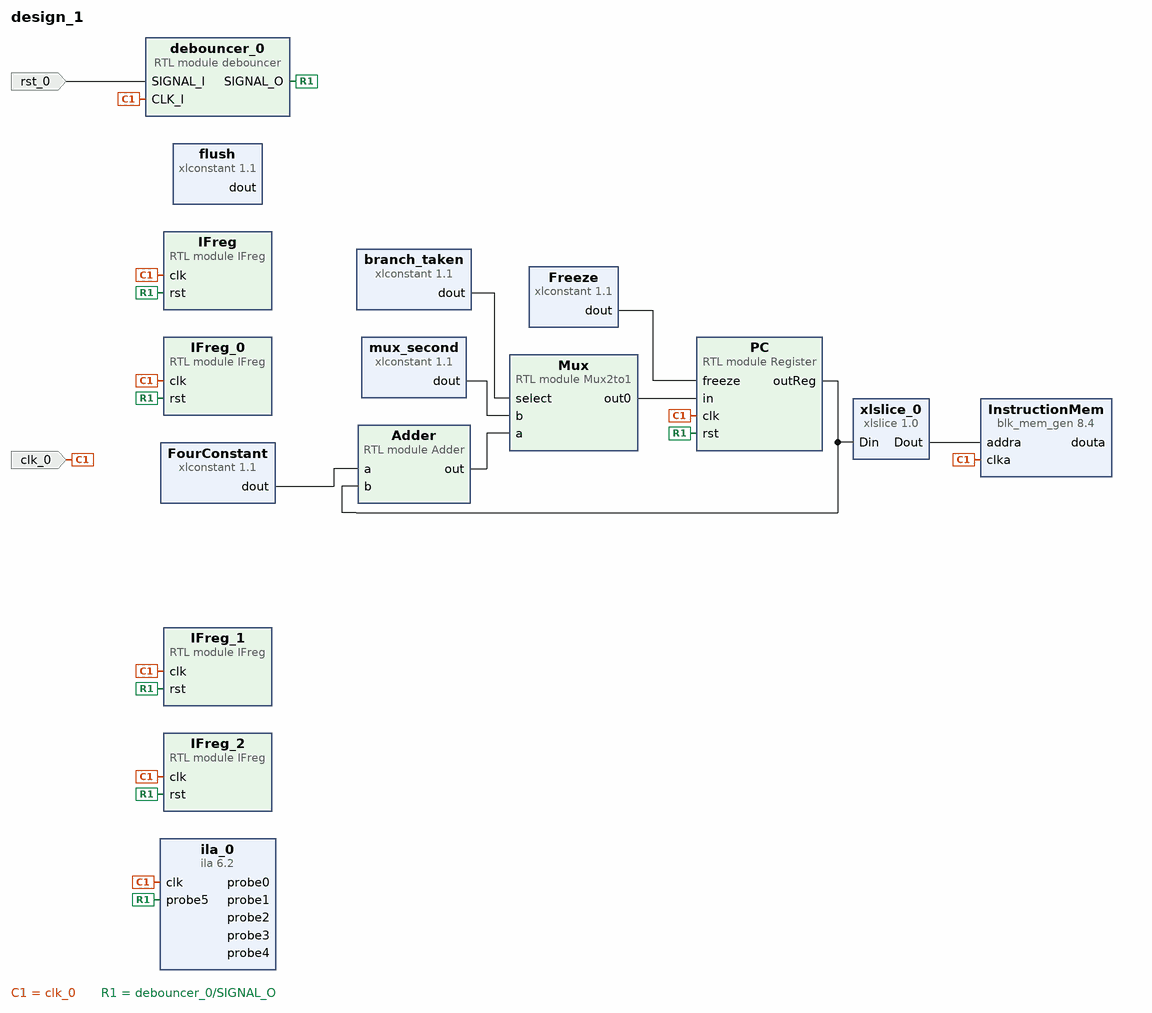
[diagram p0: block diagram of the top level]
# Vivado block design design_1, xc7z010clg400-1, Vivado 2018.3
create_bd_design design_1

create_bd_port -dir I -type clk clk_0
create_bd_port -dir I -type rst rst_0

create_bd_cell -type ip -vlnv xilinx.com:ip:xlconstant:1.1 flush
set_property -dict {CONFIG.CONST_VAL 0} [get_bd_cells flush]
create_bd_cell -type ip -vlnv xilinx.com:ip:blk_mem_gen:8.4 InstructionMem
set_property -dict [list \
  CONFIG.Coe_File ../../../../imports/src/output.coe \
  CONFIG.Enable_32bit_Address false \
  CONFIG.Enable_A Always_Enabled \
  CONFIG.Load_Init_File true \
  CONFIG.Memory_Type Single_Port_ROM \
  CONFIG.Port_A_Write_Rate 0 \
  CONFIG.Register_PortA_Output_of_Memory_Primitives true \
  CONFIG.Use_RSTA_Pin false \
  CONFIG.use_bram_block Stand_Alone \
] [get_bd_cells InstructionMem]
create_bd_cell -type ip -vlnv xilinx.com:ip:xlslice:1.0 xlslice_0
set_property -dict {CONFIG.DIN_FROM 12 CONFIG.DOUT_WIDTH 13} [get_bd_cells xlslice_0]
create_bd_cell -type ip -vlnv xilinx.com:ip:xlconstant:1.1 FourConstant
set_property -dict {CONFIG.CONST_VAL 1 CONFIG.CONST_WIDTH 32} [get_bd_cells FourConstant]
create_bd_cell -type ip -vlnv xilinx.com:ip:xlconstant:1.1 mux_second
set_property -dict {CONFIG.CONST_VAL 0 CONFIG.CONST_WIDTH 32} [get_bd_cells mux_second]
create_bd_cell -type ip -vlnv xilinx.com:ip:xlconstant:1.1 branch_taken
set_property -dict {CONFIG.CONST_VAL 0} [get_bd_cells branch_taken]
create_bd_cell -type ip -vlnv xilinx.com:ip:xlconstant:1.1 Freeze
set_property -dict {CONFIG.CONST_VAL 0} [get_bd_cells Freeze]
create_bd_cell -type module -reference Mux2to1 Mux
create_bd_cell -type module -reference Register PC
create_bd_cell -type ip -vlnv xilinx.com:ip:ila:6.2 ila_0
set_property -dict [list \
  CONFIG.C_ENABLE_ILA_AXI_MON false \
  CONFIG.C_MONITOR_TYPE Native \
  CONFIG.C_NUM_OF_PROBES 6 \
  CONFIG.C_PROBE0_TYPE 1 \
  CONFIG.C_PROBE0_WIDTH 32 \
  CONFIG.C_PROBE1_TYPE 1 \
  CONFIG.C_PROBE1_WIDTH 32 \
  CONFIG.C_PROBE2_TYPE 1 \
  CONFIG.C_PROBE2_WIDTH 32 \
  CONFIG.C_PROBE3_TYPE 1 \
  CONFIG.C_PROBE3_WIDTH 32 \
  CONFIG.C_PROBE4_TYPE 1 \
  CONFIG.C_PROBE4_WIDTH 32 \
  CONFIG.C_PROBE5_TYPE 2 \
] [get_bd_cells ila_0]
create_bd_cell -type module -reference debouncer debouncer_0
create_bd_cell -type module -reference Adder Adder
create_bd_cell -type module -reference IFreg IFreg
create_bd_cell -type module -reference IFreg IFreg_0
create_bd_cell -type module -reference IFreg IFreg_1
create_bd_cell -type module -reference IFreg IFreg_2

# ---- connections ----

connect_bd_net -net Adder_0_out [get_bd_pins Adder/out] [get_bd_pins Mux/a]
connect_bd_net -net clk_0_1 [get_bd_ports clk_0] \
  [get_bd_pins InstructionMem/clka] [get_bd_pins PC/clk] [get_bd_pins ila_0/clk] [get_bd_pins debouncer_0/CLK_I] \
  [get_bd_pins IFreg/clk] [get_bd_pins IFreg_0/clk] [get_bd_pins IFreg_1/clk] [get_bd_pins IFreg_2/clk]
# net IFreg_pcOut has one end: ila_0/probe1
# net IFreg_0_pcOut has one end: ila_0/probe2
# net IFreg_1_pcOut has one end: ila_0/probe3
connect_bd_net [get_bd_pins Freeze/dout] [get_bd_pins PC/freeze]
# net flush_dout has one end: flush/dout
# net IFreg_2_pcOut has one end: ila_0/probe4
connect_bd_net [get_bd_pins xlslice_0/Dout] [get_bd_pins InstructionMem/addra]
connect_bd_net [get_bd_pins branch_taken/dout] [get_bd_pins Mux/select]
connect_bd_net [get_bd_pins mux_second/dout] [get_bd_pins Mux/b]
connect_bd_net -net Mux2to1_0_out [get_bd_pins Mux/out0] [get_bd_pins PC/in]
connect_bd_net -net PC_out [get_bd_pins PC/outReg] [get_bd_pins xlslice_0/Din] [get_bd_pins Adder/b]
connect_bd_net -net xlconstant_0_dout [get_bd_pins FourConstant/dout] [get_bd_pins Adder/a]
connect_bd_net -net rst_0_1 [get_bd_ports rst_0] [get_bd_pins debouncer_0/SIGNAL_I]
connect_bd_net [get_bd_pins debouncer_0/SIGNAL_O] \
  [get_bd_pins PC/rst] [get_bd_pins ila_0/probe5] [get_bd_pins IFreg/rst] [get_bd_pins IFreg_0/rst] [get_bd_pins IFreg_1/rst] \
  [get_bd_pins IFreg_2/rst]
# net InstructionMem_douta has one end: InstructionMem/douta
# net IFreg_2_instructionOut has one end: ila_0/probe0

validate_bd_design
save_bd_design
